# EAGLE schematic led (EAGLE 8.3.2)
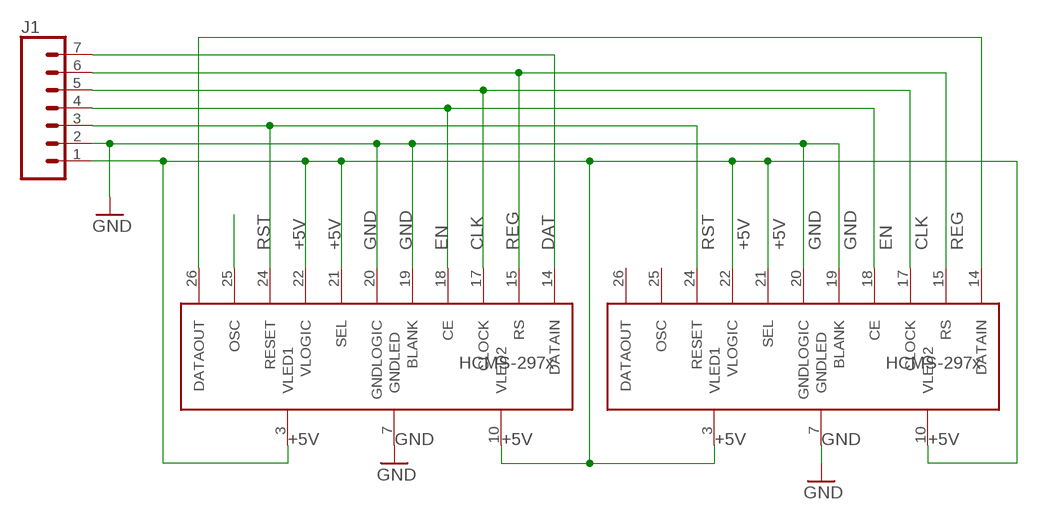
[diagram p0: schematic, sheet 1]

## Parts
J1  CONN_07LONGPADS  [1X07_LONGPADS]
U$1  HCMS-297X  [HCMS-297X]
U$2  HCMS-297X  [HCMS-297X]

## Nets
+5V: J1.1 U$1.3(VLED1) U$1.10(VLED2) U$1.21(SEL) U$1.22(VLOGIC) U$2.3(VLED1) U$2.10(VLED2) U$2.21(SEL) U$2.22(VLOGIC)
CLK: J1.5 U$1.17(CLOCK) U$2.17(CLOCK)
DAT: J1.7 U$1.14(DATAIN)
EN: J1.4 U$1.18(CE) U$2.18(CE)
GND: J1.2 U$1.7(GNDLED) U$1.19(BLANK) U$1.20(GNDLOGIC) U$2.7(GNDLED) U$2.19(BLANK) U$2.20(GNDLOGIC)
N$5: U$1.26(DATAOUT) U$2.14(DATAIN)
N$6: U$1.25(OSC)
REG: J1.6 U$1.15(RS) U$2.15(RS)
RST: J1.3 U$1.24(RESET) U$2.24(RESET)
Unconnected: U$2.25(OSC) U$2.26(DATAOUT)

## Library data of the parts
J1 = SparkFun-Connectors:CONN_07: Multi connection point. Often used as Generic Header-pin footprint for 0.1 inch spaced/style header connections On any of the 0.1 inch spaced packages, you can populate with these: Break Away Headers - Straight <https://www.sparkfun.com/products/116> (PRT-00116) Break Away Male Headers - Right Angle <https://www.sparkfun.com/products/553> (PRT-00553) Female Headers <https://www.sparkfun.com/products/115> (PRT-00115) Break Away Headers - Machine Pin <https://www.sparkfun.com/products/117> (PRT-00117) Break Away Female Headers - Swiss Machine Pin <https://www.sparkfun.com/products/743> (PRT-00743) For SCREWTERMINALS and SPRING TERMINALS visit here: Screw Terimnals on SparkFun.com <https://www.sparkfun.com/search/results?term=Screw+Terminals> (5mm/3.5mm/2.54mm spacing) This device is also useful as a general connection point to wire up your design to another part of your project. Our various solder wires solder well into these plated through hole pads. Hook-Up Wire - Assortment (Stranded, 22 AWG) <https://www.sparkfun.com/products/11375> (PRT-11375) Hook-Up Wire - Assortment (Solid Core, 22 AWG) <https://www.sparkfun.com/products/11367> (PRT-11367) View the entire wire category on our website here <https://www.sparkfun.com/categories/141> Special notes: Molex polarized connector foot print use with SKU : PRT-08231 with associated crimp pins and housings. 1MM SMD Version SKU: PRT-10208 NOTES ON THE VARIANTS LOCK and LOCK_LONGPADS... This footprint was designed to help hold the alignment of a through-hole component (i.e. 6-pin header) while soldering it into place. You may notice that each hole has been shifted either up or down by 0.005 of an inch from it's more standard position (which is a perfectly straight line). This slight alteration caused the pins (the squares in the middle) to touch the edges of the holes. Because they are alternating, it causes a "brace" to hold the component in place. 0.005 has proven to be the perfect amount of "off-center" position when using our standard breakaway headers. Although looks a little odd when you look at the bare footprint, once you have a header in there, the alteration is very hard to notice. Also,if you push a header all the way into place, it is covered up entirely on the bottom side.
U$1 U$2 = HCMS-297X:HCMS-297X